# Altium schematic sheet UZ_D_Breakout_Board_Block_Diagram.SchDoc
size A4; PageSetup: Record=PageOptions|CenterHorizontal=True|CenterVertical=True|PrintScale=0.92|XCorrection=1.00|YCorrection=1.00|PrintKind=0|BorderSize=5000000|LeftOffset=0|BottomOffset=0|Orientation=2|PaperLength=1000|PaperWidth=1000|Scale=100|PaperSource=7|PrintQuality=-4|MediaType=1|DitherType=10|PrintScaleMode=1|PaperKind=A4; CompanyName: Technische Hochschule Nürnberg Georg Simon Ohm; Organization: UltraZohm; Address1: Kesslerplatz 12; Address2: 90489 Nürnberg; Address3: GERMANY; DocumentNumber: 1; SheetNumber: 1; SheetTotal: 5; Website: www.ultrazohm.com
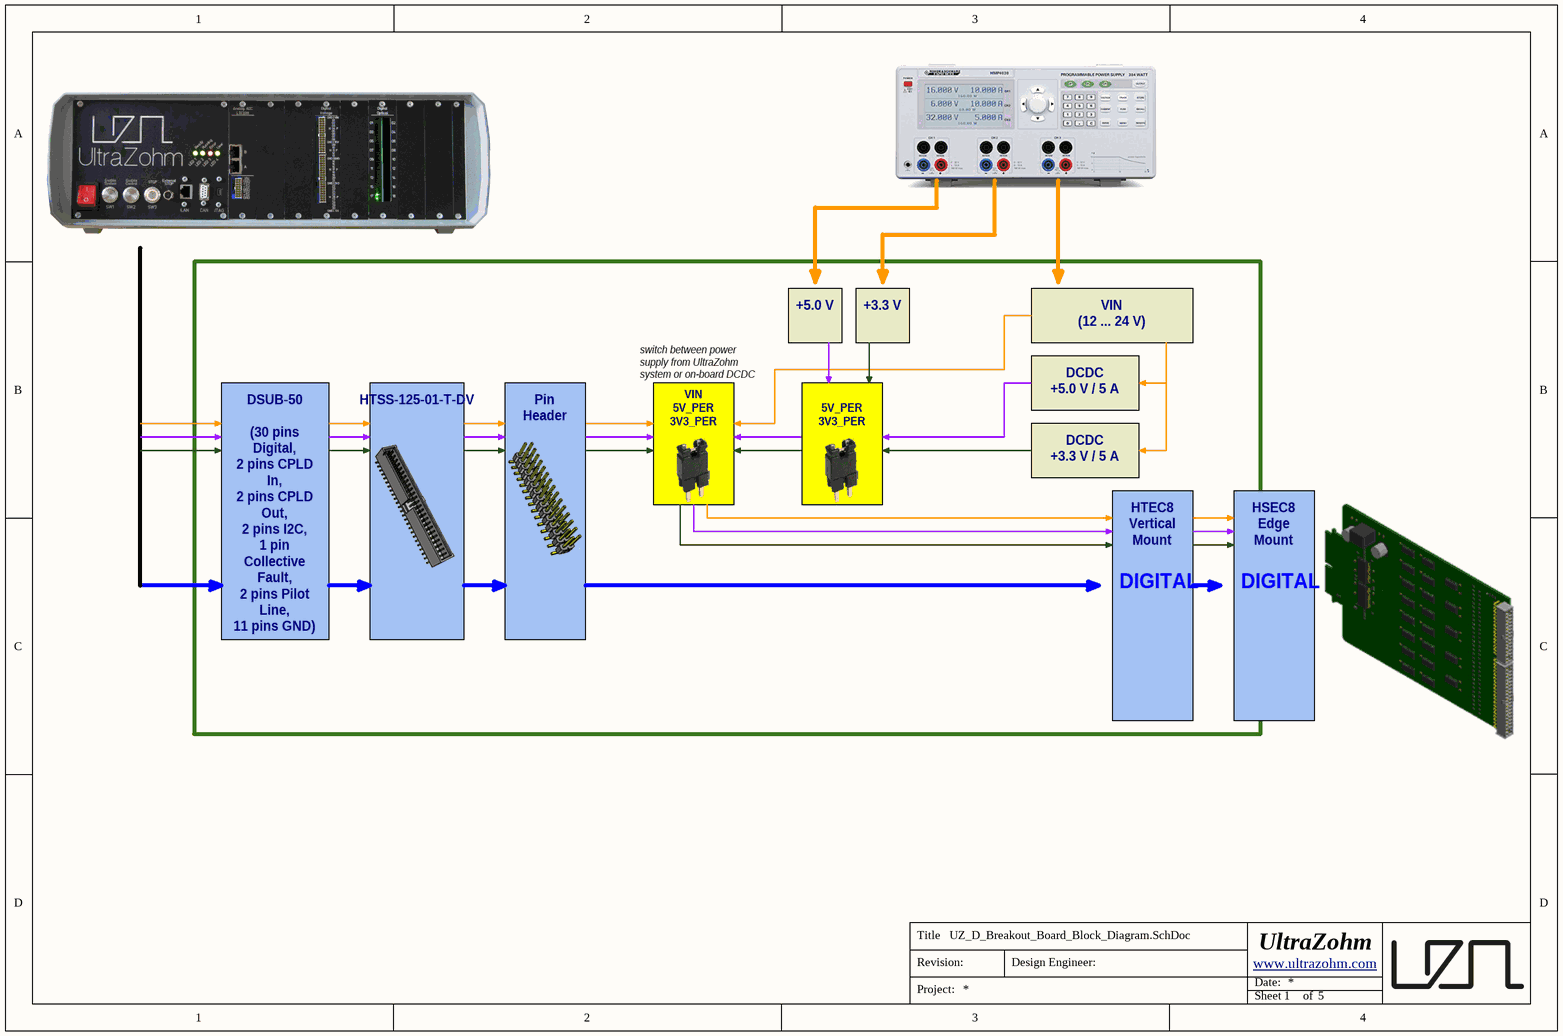
[diagram p0: UZ_D_Breakout_Board_Block_Diagram.SchDoc]

## Notes on the sheet
- switch between power supply from UltraZohm system or on-board DCDC
- +5.0 V
- +3.3 V
- VIN
  (12 ... 24 V)
- DCDC
  +5.0 V / 5 A
- VIN
  5V_PER
  3V3_PER
- 5V_PER
  3V3_PER
- DCDC
  +3.3 V / 5 A
- DSUB-50
  (30 pins Digital,
  2 pins CPLD In,
  2 pins CPLD Out,
  2 pins I2C,
  1 pin Collective Fault,
  2 pins Pilot Line,
  11 pins GND)
- HTSS-125-01-T-DV
- Pin Header
- DIGITAL
- HTEC8
  Vertical Mount
- HSEC8
  Edge Mount
- Title
- Revision:
- Design Engineer:
- Date:
- Project:
- Sheet
- of